# Altium schematic sheet April12_RevB.SchDoc
size A
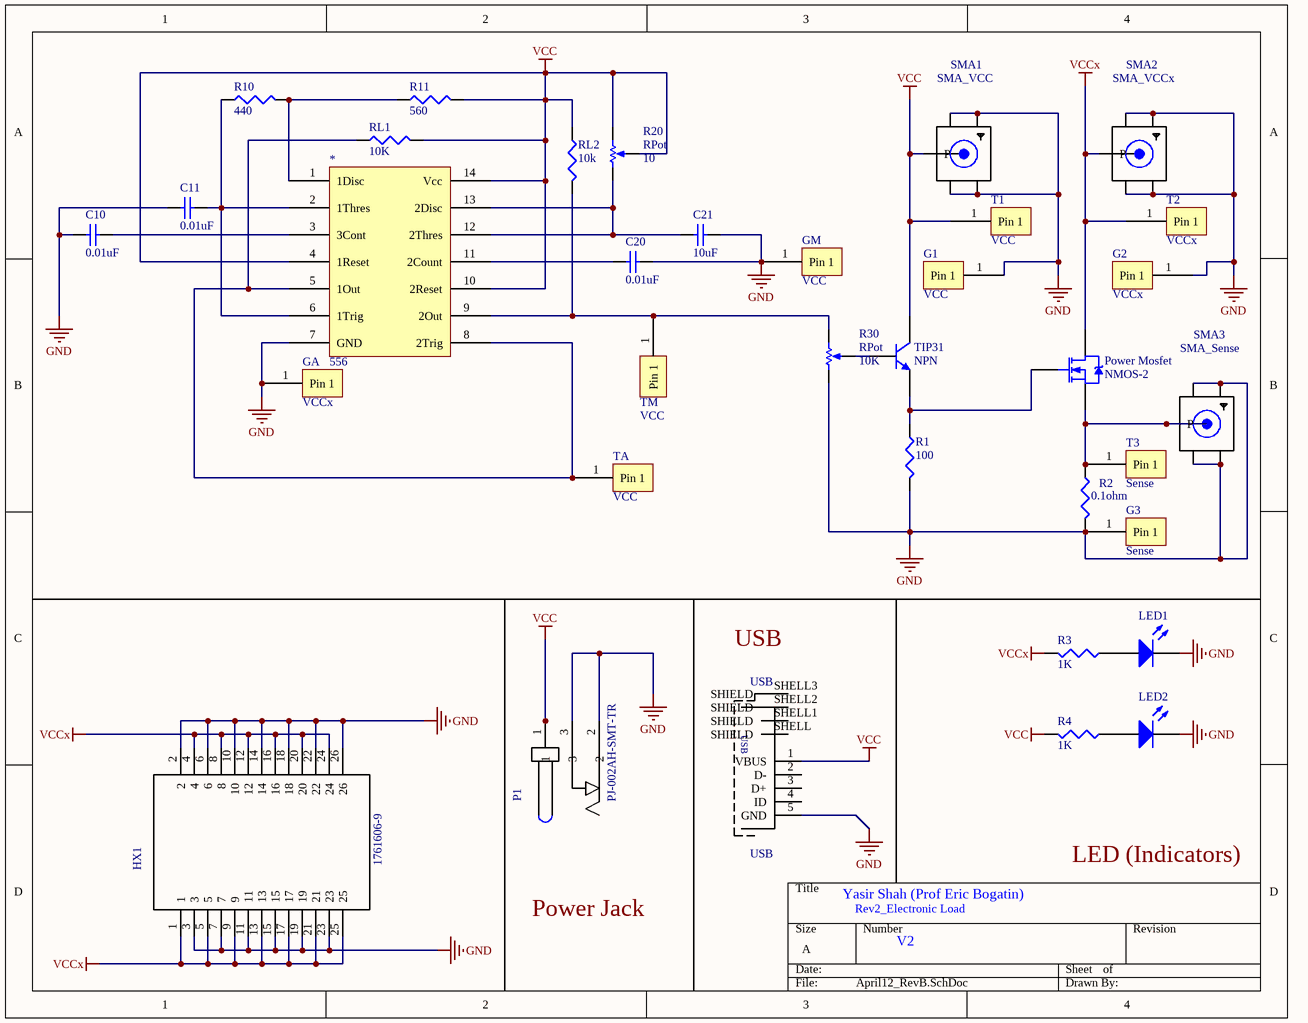
[diagram p0: April12_RevB.SchDoc]

## Parts
*  556  [556 timer]
C10  value 0.01uF  [CAPC2012X140N]  (hidden comment: Cap Semi)
C11  value 0.01uF  [CAPC2012X140N]  (hidden comment: Cap Semi)
C20  value 0.01uF  [CAPC2012X140N]  (hidden comment: Cap Semi)
C21  value 10uF  [CAPC2012X140N]  (hidden comment: Cap Semi)
G1  VCC  [1Pin Header]
G2  VCCx  [1Pin Header]
G3  Sense  [1Pin Header]
GA  VCCx  [1Pin Header]
GM  VCC  [1Pin Header]
HX1  1761606-9  [TYCO_1761606-9]
LED1  LED2  [C1206]  (value not drawn)
LED2  LED2  [C1206]  (value not drawn)
P1  PJ-002AH-SMT-TR  [CUI_PJ-002AH-SMT-TR]
Power_Mosfet  NMOS-2  [TO-220AB]
R1  value 100  [RESC2012X70]  (hidden comment: Res3)
R2  0.1ohm  [RESC3216X65]
R3  value 1K  [RESC2012X70]  (hidden comment: Res3)
R4  value 1K  [RESC2012X70]  (hidden comment: Res3)
R10  value 440  [RESC2012X70]  (hidden comment: Res3)
R11  value 560  [RESC2012X70]  (hidden comment: Res3)
R20  RPot  value 10  [VR5]
R30  RPot  value 10K  [VR5]
RL1  value 10K  [RESC2012X70]  (hidden comment: Res3)
RL2  value 10k  [RESC2012X70]  (hidden comment: Res3)
SMA_Sense  SMA3  [sma_UserDefined]
SMA_VCC  SMA1  [sma_UserDefined]
SMA_VCCx  SMA2  [sma_UserDefined]
T1  VCC  [1Pin Header]
T2  VCCx  [1Pin Header]
T3  Sense  [1Pin Header]
TA  VCC  [1Pin Header]
TIP31  NPN  [TO-226-AA]
TM  VCC  [1Pin Header]
USB  USB  [651005136521_651005136521(Primary)]

## Nets
GND: *.7(GND) C10.2 C11.2 C20.1 C21.1 G1.1(Pin_1) G2.1(Pin_1) G3.1(Pin_1) GA.1(Pin_1) GM.1(Pin_1) HX1.2 HX1.3 HX1.6 HX1.7 HX1.10 HX1.11 HX1.14 HX1.15 HX1.18 HX1.19 HX1.22 HX1.23 HX1.26 LED1.2(K) LED2.2(K) P1.2 P1.3 R1.2 R2.2 R30.1(TOP) SMA_Sense.GND1 SMA_Sense.GND2 SMA_Sense.GND3 SMA_Sense.GND4 SMA_VCC.GND1 SMA_VCC.GND2 SMA_VCC.GND3 SMA_VCC.GND4 SMA_VCCx.GND1 SMA_VCCx.GND2 SMA_VCCx.GND3 SMA_VCCx.GND4 USB.5(GND)
VCC: *.4(1Reset) *.10(2Reset) *.14(Vcc) P1.1 R4.2 R11.2 R20.2(BOT) R20.3(TAP) RL1.2 RL2.1 SMA_VCC.P T1.1(Pin_1) TIP31.1(C) USB.1(VBUS)
VCCx: HX1.1 HX1.4 HX1.5 HX1.8 HX1.9 HX1.12 HX1.13 HX1.16 HX1.17 HX1.20 HX1.21 HX1.24 HX1.25 Power_Mosfet.2(D) R3.2 SMA_VCCx.P T2.1(Pin_1)
Net*_1: *.1(1Disc) R10.2 R11.1
Net*_2: *.2(1Thres) *.6(1Trig) C11.1 R10.1
Net*_3: *.3(3Cont) C10.1
Net*_5: *.5(1Out) *.8(2Trig) RL1.1 TA.1(Pin_1)
Net*_9: *.9(2Out) R30.2(BOT) RL2.2 TM.1(Pin_1)
Net*_11: *.11(2Count) C20.2
Net*_12: *.12(2Thres) *.13(2Disc) C21.2 R20.1(TOP)
NetLED1_1: LED1.1(A) R3.1
NetLED2_1: LED2.1(A) R4.1
NetPower_Mosfet_1: Power_Mosfet.1(G) R1.1 TIP31.3(E)
NetPower_Mosfet_3: Power_Mosfet.3(S) R2.1 SMA_Sense.P T3.1(Pin_1)
NetR30_3: R30.3(TAP) TIP31.2(B)

Not connected (* = marked no-connect by the designer): USB 2(D-) 3(D+) 4(ID) SHELL(SHIELD) SHELL1(SHIELD) SHELL2(SHIELD) SHELL3(SHIELD)

## Notes on the sheet
- (near USB) USB
- Yasir Shah (Prof Eric Bogatin)
- Rev2_Electronic Load
- LED (Indicators)
- Power Jack
- V2

## Library data of the parts
C10 C11 C20 C21 = Cap Semi: Capacitor (Semiconductor SIM Model); Published: 8-Jun-2000; LatestRevisionDate: 29-May-2009; LatestRevisionNote: IPC-7351 Footprint Added.; PackageReference: C1206; Publisher: Altium Limited; PackageDescription: Chip Capacitor
G1-G3 GA GM T1-T3 TA TM = 1Pin Header
HX1 = 1761606-9: Header, Pin, Idc, Amp-Latch, 26 Pos, Low Profile, Pcb, Vertical, Black; MF: TE Connectivity; Link: http://www.te.com/usa-en/product-1761606-9.html; Package: None; EU_RoHS_Compliance: Compliant; MP: 1761606-9; Availability: Good; Price: 4.02 USD; SnapEDA_Link: https://www.snapeda.com/symbols-footprints/1761606-9/TE%20Connectivity%20AMP%20Connectors/view-part/?ref=snap; Value: *
LED1 LED2 = LED2: Typical RED, GREEN, YELLOW, AMBER GaAs LED; Published: 8-Jun-2000; LatestRevisionDate: 17-Jul-2002; LatestRevisionNote: Re-released for DXP Platform.; PackageVersion: Feb-2002; PackageReference: 3.2X1.6X1.1; Publisher: Altium Limited; PackageDescription: SM LED; 2 Flat Leads
P1 = PJ-002AH-SMT-TR: 24 VDC 5 A Surface Mount Unshielded 2 Conductors 3 Contacts Male Power Jack; MF: CUI; Package: None; MP: PJ-002AH-SMT-TR; Availability: Good; Price: 1.03 USD; SnapEDA_Link: https://www.snapeda.com/symbols-footprints/PJ-002AH-SMT-TR/CUI%20Inc/view-part/?ref=snap; Value: *
Power_Mosfet = NMOS-2: N-Channel Power MOSFET; Note: Pin 2 is electrically connected to pin 4.; Published: 8-Jun-2000; LatestRevisionDate: 17-Jul-2002; LatestRevisionNote: Re-released for DXP Platform.; DatasheetVersion: PD-9.814; PackageVersion: Feb-1997; PackageReference: TO-220AB; Publisher: Altium Limited; PackageDescription: TO, Thru-Hole, Vertical, Heatsink Mounted; 3 In-Line Leads; Pitch 2.54 mm; ComponentLink1Description: Manufacturer Link; ComponentLink1URL: http://www.irf.com/
R1-R4 R10 R11 RL1 RL2 = Res3: Resistor; Published: 8-Jun-2000; LatestRevisionDate: 29-May-2009; LatestRevisionNote: IPC-7351 Footprint Added.; PackageReference: J1-0603; Publisher: Altium Limited; PackageDescription: Chip Resistor
R20 R30 = RPot: Potentiometer; Sim Note: Enter the Resistance value and the set point into parameter fields.; Set Position: 0.5; Published: 8-Jun-2000; LatestRevisionDate: 17-Jul-2002; LatestRevisionNote: Re-released for DXP Platform.; PackageReference: VR5; Publisher: Altium Limited; PackageDescription: Variable Resistor, Thru-Hole; 3 Leads
SMA_Sense SMA_VCC SMA_VCCx = 1865: Edge-Launch SMA Connector for 1.6mm / 0.062 Thick PCBs; MF: Keystone; Availability: Bad; SnapEDA_Link: https://www.snapeda.com/symbols-footprints/1865/Keystone%20Electronics/view-part/?ref=snap; Package: None; MP: 1865; Price: 2.38 USD; Value: *
TIP31 = NPN: NPN Bipolar Transistor; Published: 8-Jun-2000; LatestRevisionDate: 17-Jul-2002; LatestRevisionNote: Re-released for DXP Platform.; PackageReference: TO-226-AA; Publisher: Altium Limited; PackageDescription: TO, Flat Index; 3 In-Line, Axial Leads; Body Dia. 4.8mm; Leads 0.55 x 0.51 mm (max); Code_JEDEC: TO-226-AA
USB = 651005136521: MINI USB A - 5POS Horizontal through hole; MF: Wurth Electronics; SnapEDA_Link: https://www.snapeda.com/symbols-footprints/651005136521/Wurth%20Electronics%20Inc/view-part/?ref=snap; MP: 651005136521; Package: None; Availability: Good; Price: 1.78 USD; Value: *